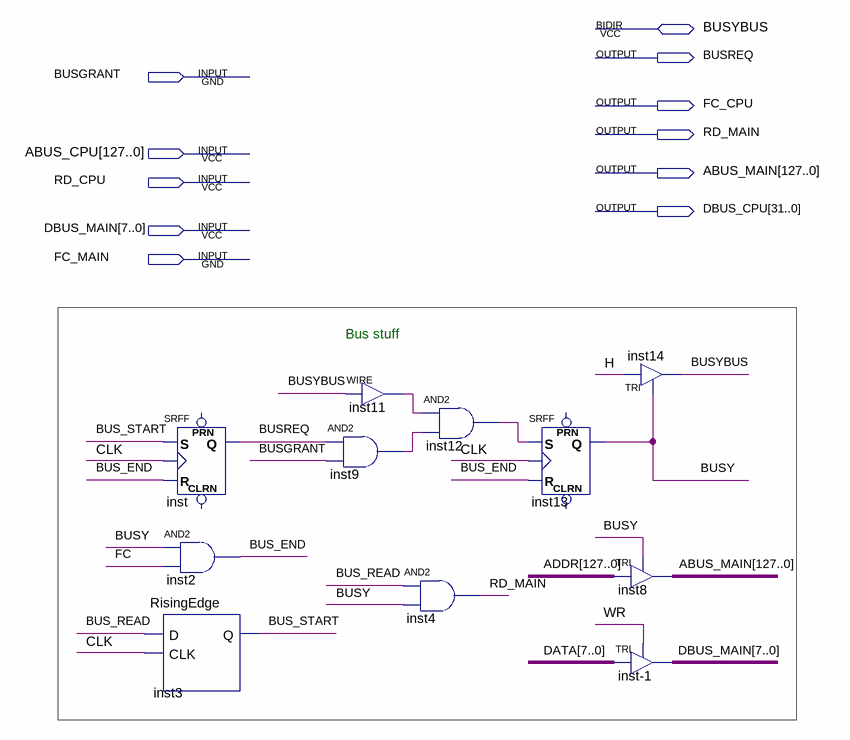
[diagram p0: schematic sheet]
// Quartus schematic ICache.bdf as structural Verilog: 11 symbols, 11 pins
module ICache (
  input  BUSGRANT,
  input  [127:0] ABUS_CPU,
  input  RD_CPU,
  input  [7:0] DBUS_MAIN,
  input  FC_MAIN,
  inout  BUSYBUS,
  output BUSREQ,
  output FC_CPU,
  output RD_MAIN,
  output [127:0] ABUS_MAIN,
  output [31:0] DBUS_CPU
);

  wire BUS_END, BUS_READ, BUS_START, BUSY, CLK, FC, H, inst9_out, inst11_out, inst12_out, WR;
  wire [7:0] DATA;
  wire [127:0] ADDR;

  RisingEdge inst3 (.D(BUS_READ), .CLK(CLK), .Q(BUS_START));
  SRFF inst (.S(BUS_START), .R(BUS_END), .CLK(CLK), .Q(BUSREQ));  // open: PRN, CLRN
  and inst2 (BUS_END, BUSY, FC);
  assign inst11_out = BUSYBUS;  // WIRE inst11
  and inst9 (inst9_out, BUSREQ, BUSGRANT);
  and inst12 (inst12_out, inst11_out, inst9_out);
  and inst4 (RD_MAIN, BUS_READ, BUSY);
  SRFF inst13 (.S(inst12_out), .R(BUS_END), .CLK(CLK), .Q(BUSY));  // open: PRN, CLRN
  TRI inst8[127:0] (.IN(ADDR), .OE(BUSY), .OUT(ABUS_MAIN));
  TRI \inst-1 [7:0] (.IN(DATA), .OE(WR), .OUT(DBUS_MAIN));
  TRI inst14 (.IN(H), .OE(BUSY), .OUT(BUSYBUS));

  // Notes on the sheet:
  //   Bus stuff
endmodule
